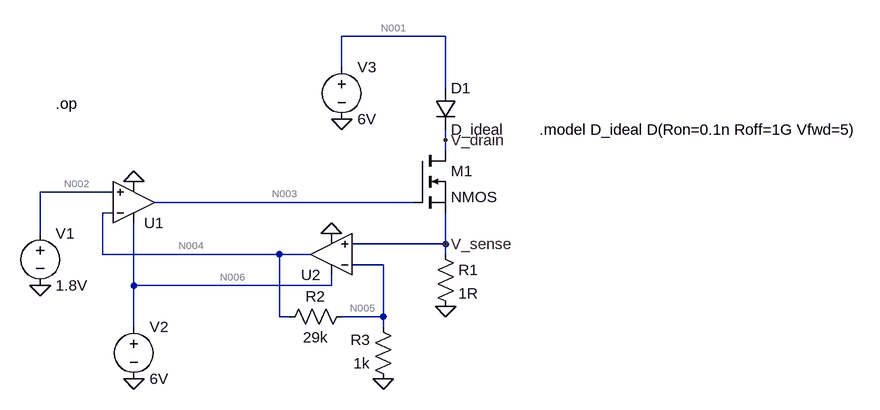
[diagram p0: schematic simulation.asc]
simulation.asc, the LTspice schematic file:
Version 4
SHEET 1 1244 680
WIRE 560 -1024 400 -1024
WIRE 400 -976 400 -1024
WIRE 560 -944 560 -1024
WIRE 560 -864 560 -880
WIRE 560 -848 560 -864
WIRE 48 -784 -64 -784
WIRE 512 -768 112 -768
WIRE 48 -752 32 -752
WIRE -64 -720 -64 -784
WIRE 560 -704 560 -752
WIRE 560 -704 416 -704
WIRE 32 -688 32 -752
WIRE 304 -688 32 -688
WIRE 352 -688 304 -688
WIRE 560 -688 560 -704
WIRE 464 -672 416 -672
WIRE 80 -640 80 -736
WIRE 384 -640 384 -656
WIRE 384 -640 80 -640
WIRE 304 -592 304 -688
WIRE 320 -592 304 -592
WIRE 464 -592 464 -672
WIRE 464 -592 400 -592
WIRE 80 -576 80 -640
WIRE 464 -576 464 -592
FLAG -64 -640 0
FLAG 80 -496 0
FLAG 560 -608 0
FLAG 384 -720 0
FLAG 80 -800 0
FLAG 464 -496 0
FLAG 400 -896 0
FLAG 560 -704 V_sense
FLAG 560 -864 V_drain
SYMBOL OpAmps\\UniversalOpAmp 80 -768 M180
SYMATTR InstName U1
SYMBOL OpAmps\\UniversalOpAmp 384 -688 R180
SYMATTR InstName U2
SYMBOL diode 544 -944 R0
SYMATTR InstName D1
SYMATTR Value D_ideal
SYMBOL nmos 512 -848 R0
SYMATTR InstName M1
SYMBOL voltage -64 -736 R0
WINDOW 123 0 0 Left 0
WINDOW 39 0 0 Left 0
SYMATTR InstName V1
SYMATTR Value 1.8V
SYMBOL voltage 80 -592 R0
WINDOW 123 0 0 Left 0
WINDOW 39 0 0 Left 0
SYMATTR InstName V2
SYMATTR Value 6V
SYMBOL res 544 -704 R0
SYMATTR InstName R1
SYMATTR Value 1R
SYMBOL res 416 -608 R90
WINDOW 0 0 56 VBottom 2
WINDOW 3 32 56 VTop 2
SYMATTR InstName R2
SYMATTR Value 29k
SYMBOL res 480 -480 R180
WINDOW 0 36 76 Left 2
WINDOW 3 36 40 Left 2
SYMATTR InstName R3
SYMATTR Value 1k
SYMBOL voltage 400 -992 R0
WINDOW 123 0 0 Left 0
WINDOW 39 0 0 Left 0
SYMATTR InstName V3
SYMATTR Value 6V
TEXT -40 -920 Left 2 !.op
TEXT 704 -880 Left 2 !.model D_ideal D(Ron=0.1n Roff=1G Vfwd=5)

The netlist it stands for:
* simulation.asc
XU1 N002 N004 N006 0 N003 level1 Avol=1Meg GBW=10Meg Vos=0 En=0 Enk=0 In=0 Ink=0 Rin=500Meg  ; pins In+ In- V+ V- OUT
XU2 V_sense N005 N006 0 N004 level1 Avol=1Meg GBW=10Meg Vos=0 En=0 Enk=0 In=0 Ink=0 Rin=500Meg  ; pins In+ In- V+ V- OUT
D1 N001 V_drain D_ideal
M1 V_drain N003 V_sense V_sense NMOS
V1 N002 0 1.8V
V2 N006 0 6V
R1 V_sense 0 1R
R2 N005 N004 29k
R3 0 N005 1k
V3 N001 0 6V
.model D D
.lib standard.dio
.model NMOS NMOS
.model PMOS PMOS
.lib standard.mos
.op
.model D_ideal D(Ron=0.1n Roff=1G Vfwd=5)
.lib UniversalOpAmp1.lib
.backanno
.end

* Results of the author's LTspice run, read from the files saved beside the schematic
* Operating Point:
*   V(n004) = 1.797 V
*   V(n002) = 1.8 V
*   V(n003) = 3.186 kV
*   V(n006) = 6 V
*   V(n005) = 59.9 mV
*   V(v_sense) = 59.9 mV
*   V(n001) = 6 V
*   V(v_drain) = 1 V
*   Id(M1) = 59.9 mA
*   Ig(M1) = 0 A
*   Ib(M1) = -950.1 fA
*   Is(M1) = -59.9 mA
*   I(D1) = 59.91 mA
*   I(R1) = 59.9 mA
*   I(R2) = -59.89 µA
*   I(R3) = -59.9 µA
*   I(V1) = 2.4 nA
*   I(V2) = -20.28 nA
*   I(V3) = -59.91 mA
*   Ix(u1:1) = -2.4 nA
*   Ix(u1:2) = -2.406 nA
*   Ix(u1:3) = 8.403 nA
*   Ix(u1:4) = -3.597 nA
*   Ix(u1:5) = -1.604 nA
*   Ix(u2:1) = -5.88 nA
*   Ix(u2:2) = -5.88 nA
*   Ix(u2:3) = 11.88 nA
*   Ix(u2:4) = -119.8 pA
*   Ix(u2:5) = -59.89 µA
* From the log:
*   Semiconductor Device Operating Points:
*                           --- Diodes ---
*   Name:      d1
*   Model:   d_ideal
*   Id:      5.99e-02
*   Vd:      5.00e+00
*   Req:     1.00e+10
*   CAP:     0.00e+00
*                           --- MOSFET Transistors ---
*   Name:          m1
*   Model:        nmos
*   Id:          5.99e-02
*   Vgs:         3.19e+03
*   Vds:         9.40e-01
*   Vbs:         0.00e+00
*   Vth:         0.00e+00
*   Vdsat:       3.19e+03
*   Gm:          1.88e-05
*   Gds:         6.37e-02
*   Gmb:         0.00e+00
*   Cbd:         0.00e+00
*   Cbs:         0.00e+00
*   Cgsov:       0.00e+00
*   Cgdov:       0.00e+00
*   Cgbov:       0.00e+00
*   Cgs:         0.00e+00
*   Cgd:         0.00e+00
*   Cgb:         0.00e+00